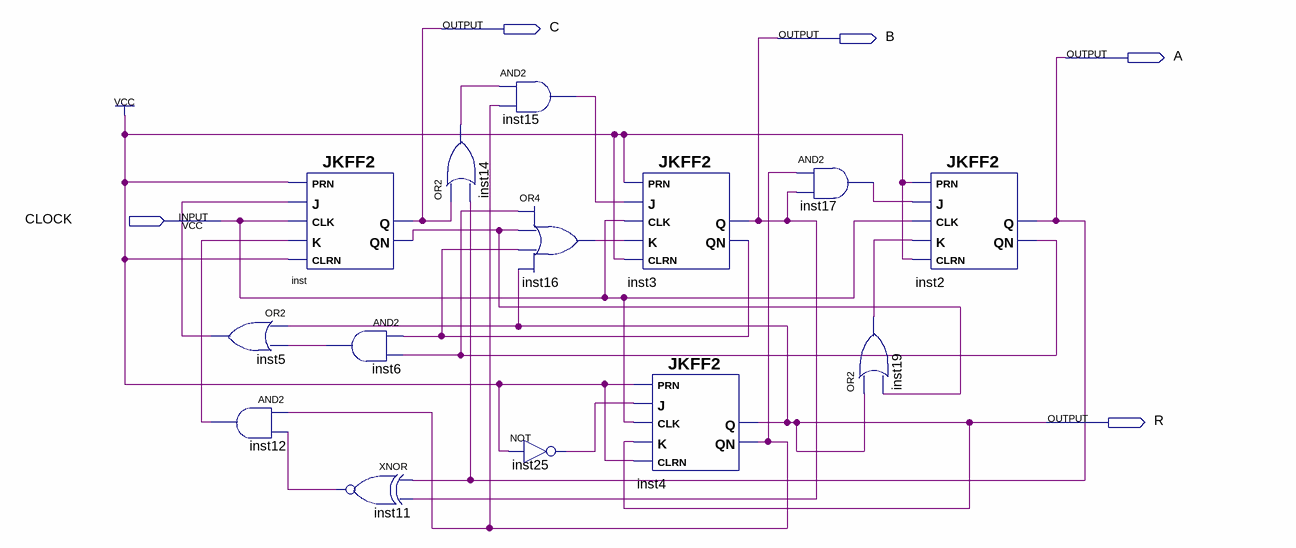
[diagram p0: schematic sheet]
// Quartus schematic ex2-lista4.bdf as structural Verilog: 14 symbols, 5 pins
module \ex2-lista4  (
  input  CLOCK,
  output C,
  output B,
  output A,
  output R
);

  wire inst2_qn, inst3_qn, inst4_qn, inst5_out, inst6_out, inst11_out, inst12_out, inst14_out, inst15_out,
       inst16_out, inst17_out, inst19_out, inst25_out, inst_qn;

  or inst5 (inst5_out, R, inst6_out);
  and inst12 (inst12_out, inst4_qn, inst11_out);
  JKFF2 inst (.K(inst12_out), .CLRN(1'b1), .CLK(CLOCK), .PRN(1'b1), .J(inst5_out), .QN(inst_qn), .Q(C));
  and inst6 (inst6_out, inst3_qn, inst2_qn);
  xnor inst11 (inst11_out, A, B);
  or inst14 (inst14_out, C, A);
  and inst15 (inst15_out, inst14_out, inst4_qn);
  or inst16 (inst16_out, inst2_qn, inst_qn, inst3_qn, R);
  not inst25 (inst25_out, 1'b1);
  JKFF2 inst3 (.K(inst16_out), .CLRN(1'b1), .CLK(CLOCK), .PRN(1'b1), .J(inst15_out), .QN(inst3_qn), .Q(B));
  JKFF2 inst4 (.K(R), .CLRN(1'b1), .CLK(CLOCK), .PRN(1'b1), .J(inst25_out), .QN(inst4_qn), .Q(R));
  and inst17 (inst17_out, inst4_qn, B);
  or inst19 (inst19_out, R, inst_qn);
  JKFF2 inst2 (.K(inst19_out), .CLRN(1'b1), .CLK(CLOCK), .PRN(1'b1), .J(inst17_out), .QN(inst2_qn), .Q(A));
endmodule
